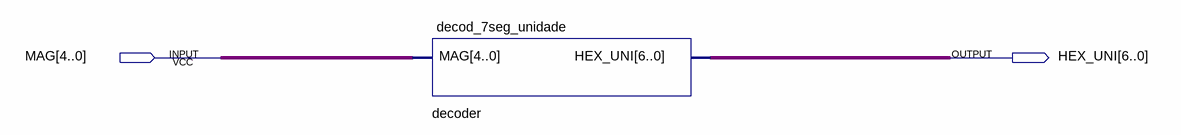
[diagram p0: schematic sheet]
// Quartus schematic decof7_unidade.bdf as structural Verilog: 1 symbols, 2 pins
module decof7_unidade (
  input  [4:0] MAG,
  output [6:0] HEX_UNI
);

  decod_7seg_unidade decoder (.MAG(MAG), .HEX_UNI(HEX_UNI));
endmodule
